# Altium schematic sheet MAIN.SchDoc: =DocumentName
size A4; CompanyName: "AS Manufacturing" LLC; Organization: "AS Manufacturing" LLC; Address1: 5 Sklyarenka St.; Address2: Kyiv 04073; Address3: Ukraine; Address4: https://ajax.systems/en/; DocumentNumber: 1; SheetNumber: 1; SheetTotal: 7; Template_version: 1.0.1
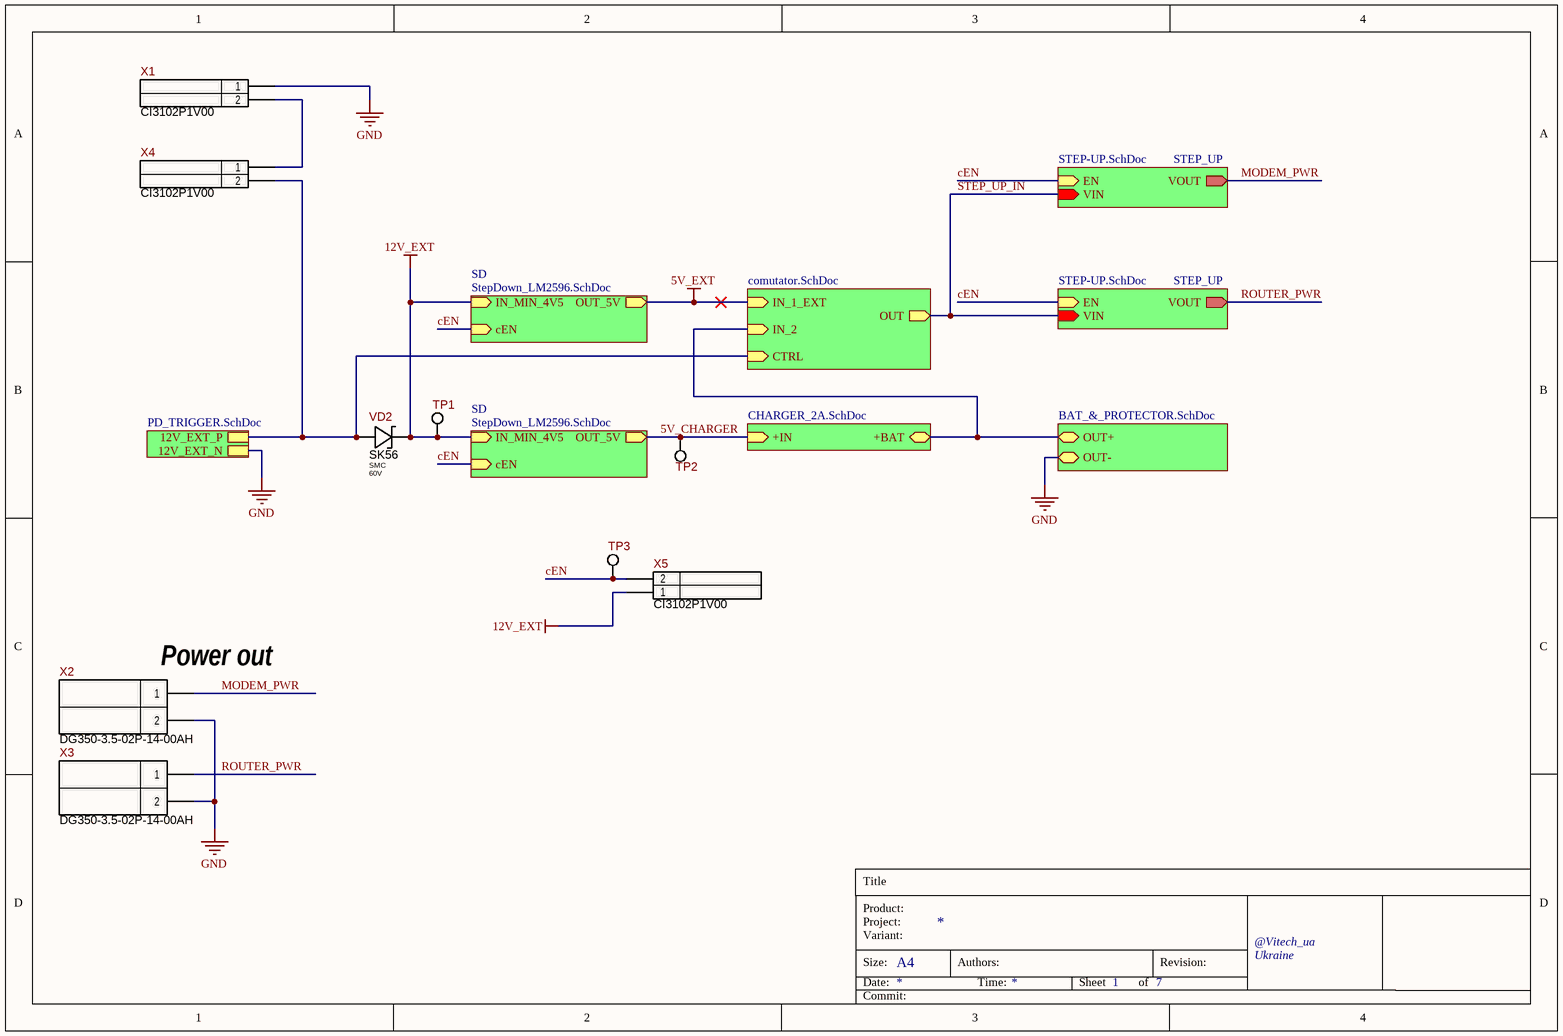
[diagram p0: MAIN.SchDoc]

## Parts
TP1  PAD-0.96mm  [PAD-0.96mm]  (value not drawn)  (no BOM)
TP2  PAD-0.96mm  [PAD-0.96mm]  (value not drawn)  (no BOM)
TP3  PAD-0.96mm  [PAD-0.96mm]  (value not drawn)  (no BOM)
VD2  Voltage: 60V  [SMC]  (hidden comment: SK56)
X1  WH-02S  [WF-2S]  (value not drawn)
X2  DG350-3.5-02P  [DG350-3.5-02P-14-00AH]  (value not drawn)  (no BOM)
X3  DG350-3.5-02P  [DG350-3.5-02P-14-00AH]  (value not drawn)  (no BOM)
X4  WH-02S  [WF-2S]  (value not drawn)
X5  WH-02S  [WF-2S]  (value not drawn)

## Sub-sheets
charger = CHARGER_2A.SchDoc: +BAT (bidir), +IN (in)
COMUTATOR = comutator.SchDoc: IN_1_EXT (in), IN_2 (in), OUT (out), CTRL (in)
Designator = PD_TRIGGER.SchDoc: 12V_EXT_P, 12V_EXT_N
pROTECTOR = BAT_&_PROTECTOR.SchDoc: OUT+ (bidir), OUT- (bidir)
SD = StepDown_LM2596.SchDoc: IN_MIN_4V5 (in), OUT_5V (out), cEN (in)
SD = StepDown_LM2596.SchDoc: IN_MIN_4V5 (in), OUT_5V (out), cEN (in)
STEP_UP = STEP-UP.SchDoc: VIN (in), VOUT (out), EN (in)
STEP_UP = STEP-UP.SchDoc: VIN (in), VOUT (out), EN (in)

## Nets
5V_EXT: sheet COMUTATOR/IN_1_EXT, sheet SD/OUT_5V
12V_EXT: TP1.1 VD2.CA X5.1 ; sheet SD/IN_MIN_4V5, sheet SD/IN_MIN_4V5
GND: X1.1 X2.2 X3.2 ; sheet pROTECTOR/OUT-, sheet Designator/12V_EXT_N
5V_CHARGER: TP2.1 ; sheet charger/+IN, sheet SD/OUT_5V
cEN: TP3.1 X5.2 ; sheet STEP_UP/EN, sheet SD/cEN, sheet STEP_UP/EN, sheet SD/cEN
MODEM_PWR: X2.1 ; sheet STEP_UP/VOUT
ROUTER_PWR: X3.1 ; sheet STEP_UP/VOUT
STEP_UP_IN: sheet STEP_UP/VIN, sheet COMUTATOR/OUT, sheet STEP_UP/VIN
NetVD2_AN: VD2.AN X4.2 ; sheet COMUTATOR/CTRL, sheet Designator/12V_EXT_P
NetX1_2: X1.2 X4.1
(unnamed): sheet charger/+BAT, sheet COMUTATOR/IN_2, sheet pROTECTOR/OUT+

## Notes on the sheet
- (near X2) Power out
- Title
- Product:
- Project:
- Size:
- Date:
- Variant:
- A4
- Authors:
- Time:
- Sheet
- of
- Revision:
- @Vitech_ua
- Commit:

## Library data of the parts
TP1-TP3 = PAD-0.96mm: 0.96mm Pad for Plug-In or Receptacle; Ajax_1C_PN: NONE; Ajax_1С_Status: RND Only; Component Status: Released; Part Number: PAD-0.96mm; Component Type: PTH; Manufacturer: NONE; Part Type: Pad; Temperature Range: NONE; ComponentLink1URL: NONE; Replacement: NONE; Price: NONE; ComponentLink1Description: Datasheet
VD2 = SS34: Diode Schottky 60V 5A, SMC; Manufacturer: KLS; Component Status: Released; Standard Lead Time: 14 Weeks; Current: 3A; Vf: 500mV @ 3A; Replacement: NONE; Part Number: SK56; Package: SMC; Part Type: Schottky; Component Type: SMD; Marking: SK56; Temperature Range: -55°C ~ 150°C; Supplier 1: Digi-Key; Supplier Part Number 1: SS34FSCT-ND; Price: 0.03; ComponentLink1Description: Datasheet
X1 X4 X5 = CI3102P1V00: WH Series 2.54mm Wire to Board Straight DIP Type Headers, 2 Pin; Manufacturer: CviLux; Replacement: NONE; Part Number: CI3102P1V00; Part Type: Wire-to-Board / Header; Component Type: PTH; Temperature Range: -25℃ ~ 85℃; Price: 0.02434867; ComponentLink1Description: Datasheet
X2 X3 = DG350-3.5-02P-14-00AH: Screw Terminal, 3.5mm Pitch, 2 pin, Green; Manufacturer: Degson; Ajax_1C_ID: 21524; Ajax_1C_PN: DG350-3.5-02P-14-00AH, клеммник; Ajax_1С_Status: RND Only; Component Status: Released; Replacement: NONE; GUID_1C: 367ff815-d639-11ea-ab63-0050569f2651; Part Number: DG350-3.5-02P-14-00AH; Part Type: Terminal; Component Type: PTH; Temperature Range: -40°C ~ 105°C; ComponentLink1URL: \\altiumdb.ajax.local\files\Datasheet\Connectors\DG350-3.5,3.96.pdf; Price: 0,17091154; ComponentLink1Description: Datasheet